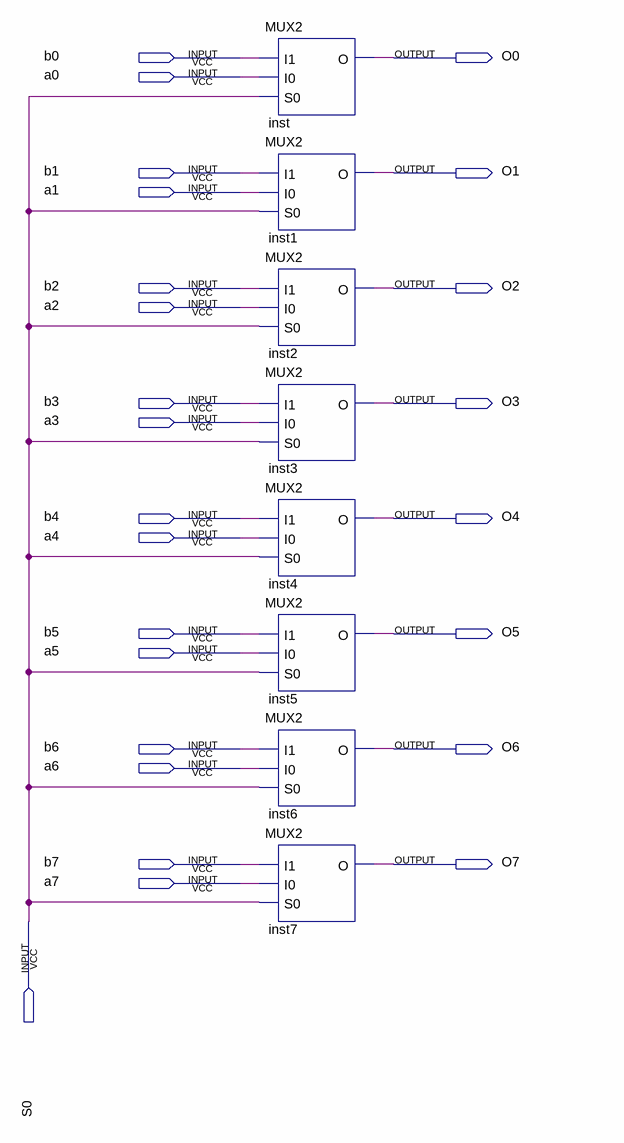
[diagram p0: schematic sheet]
// Quartus schematic MUX2-8bit.bdf as structural Verilog: 8 symbols, 25 pins
module \MUX2-8bit  (
  input  b0,
  input  a0,
  input  b1,
  input  a1,
  input  b2,
  input  a2,
  input  b3,
  input  a3,
  input  b4,
  input  a4,
  input  b5,
  input  a5,
  input  b6,
  input  a6,
  input  b7,
  input  a7,
  input  S0,
  output O0,
  output O1,
  output O2,
  output O3,
  output O4,
  output O5,
  output O6,
  output O7
);

  MUX2 inst (.I1(b0), .I0(a0), .S0(S0), .O(O0));
  MUX2 inst1 (.I1(b1), .I0(a1), .S0(S0), .O(O1));
  MUX2 inst2 (.I1(b2), .I0(a2), .S0(S0), .O(O2));
  MUX2 inst3 (.I1(b3), .I0(a3), .S0(S0), .O(O3));
  MUX2 inst4 (.I1(b4), .I0(a4), .S0(S0), .O(O4));
  MUX2 inst5 (.I1(b5), .I0(a5), .S0(S0), .O(O5));
  MUX2 inst6 (.I1(b6), .I0(a6), .S0(S0), .O(O6));
  MUX2 inst7 (.I1(b7), .I0(a7), .S0(S0), .O(O7));
endmodule
